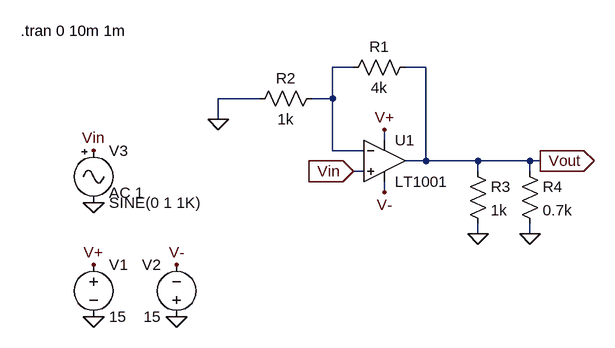
[diagram p0: schematic Simulación Transient.asc]
Simulación Transient.asc, the LTspice schematic file:
Version 4
SHEET 1 1024 680
WIRE 624 -384 592 -384
WIRE 736 -384 704 -384
WIRE 480 -336 416 -336
WIRE 592 -336 592 -384
WIRE 592 -336 560 -336
WIRE 416 -304 416 -336
WIRE 672 -272 672 -288
WIRE 592 -256 592 -336
WIRE 640 -256 592 -256
WIRE 736 -240 736 -384
WIRE 736 -240 704 -240
WIRE 816 -240 736 -240
WIRE 896 -240 816 -240
WIRE 912 -240 896 -240
WIRE 640 -224 624 -224
WIRE 816 -224 816 -240
WIRE 896 -224 896 -240
WIRE 672 -192 672 -208
WIRE 816 -128 816 -144
WIRE 896 -128 896 -144
FLAG 224 0 0
FLAG 352 0 0
FLAG 224 -80 V+
FLAG 352 -80 V-
FLAG 672 -288 V+
FLAG 672 -192 V-
FLAG 224 -176 0
FLAG 224 -256 Vin
FLAG 624 -224 Vin
IOPIN 624 -224 In
FLAG 416 -304 0
FLAG 912 -240 Vout
IOPIN 912 -240 Out
FLAG 816 -128 0
FLAG 896 -128 0
SYMBOL voltage 224 -96 R0
WINDOW 123 0 0 Left 0
WINDOW 39 0 0 Left 0
SYMATTR InstName V1
SYMATTR Value 15
SYMBOL voltage 352 16 R180
WINDOW 0 24 96 Left 2
WINDOW 3 24 16 Left 2
WINDOW 123 0 0 Left 0
WINDOW 39 0 0 Left 0
SYMATTR InstName V2
SYMATTR Value 15
SYMBOL OpAmps\\LT1001 672 -304 R0
SYMATTR InstName U1
SYMBOL Misc\\signal 224 -272 R0
WINDOW 123 24 81 Left 2
WINDOW 39 0 0 Left 0
SYMATTR InstName V3
SYMATTR Value2 AC 1
SYMBOL res 720 -400 R90
WINDOW 0 0 56 VBottom 2
WINDOW 3 32 56 VTop 2
SYMATTR InstName R1
SYMATTR Value 4k
SYMBOL res 576 -352 R90
WINDOW 0 0 56 VBottom 2
WINDOW 3 32 56 VTop 2
SYMATTR InstName R2
SYMATTR Value 1k
SYMBOL res 800 -240 R0
SYMATTR InstName R3
SYMATTR Value 1k
SYMBOL res 880 -240 R0
SYMATTR InstName R4
SYMATTR Value 0.7k
TEXT 112 -440 Left 2 !.tran 0 10m 1m

The netlist it stands for:
* Simulación Transient.asc
V1 V+ 0 15
V2 0 V- 15
XU1 Vin N001 V+ V- Vout LT1001  ; pins In+ In- V+ V- OUT
V3 Vin 0 SINE(0 1 1K) AC 1
R1 Vout N001 4k
R2 N001 0 1k
R3 Vout 0 1k
R4 Vout 0 0.7k
.tran 0 10m 1m
.lib LTC.lib
.backanno
.end

* Results of the author's LTspice run, read from the files saved beside the schematic
* Operating Point, zero values left out:
*   V(v+) = 15 V
*   V(v-) = -15 V
*   I(V1) = -2.25 mA
*   I(V2) = -2.25 mA
*   Ix(u1:3) = 2.25 mA
*   Ix(u1:4) = -2.25 mA
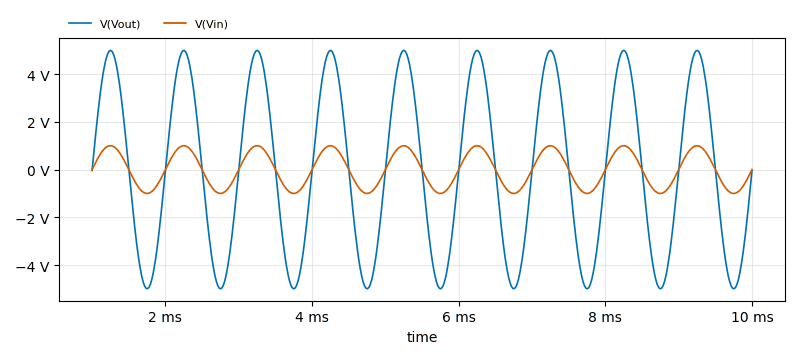
[diagram p1: Transient Analysis of Simulación Transient.asc, plotted from the saved traces]
* Transient Analysis, 1 run:
*   V(Vout): min -4.995 V, max 4.995 V, average 0 V, rms 3.53 V, last -32.07 mV
*   V(Vin): min -1 V, max 1 V, average 0 V, rms 706.7 mV, last 0 V